# EAGLE design SunbotSchematic copy (EAGLE 8.7.1)
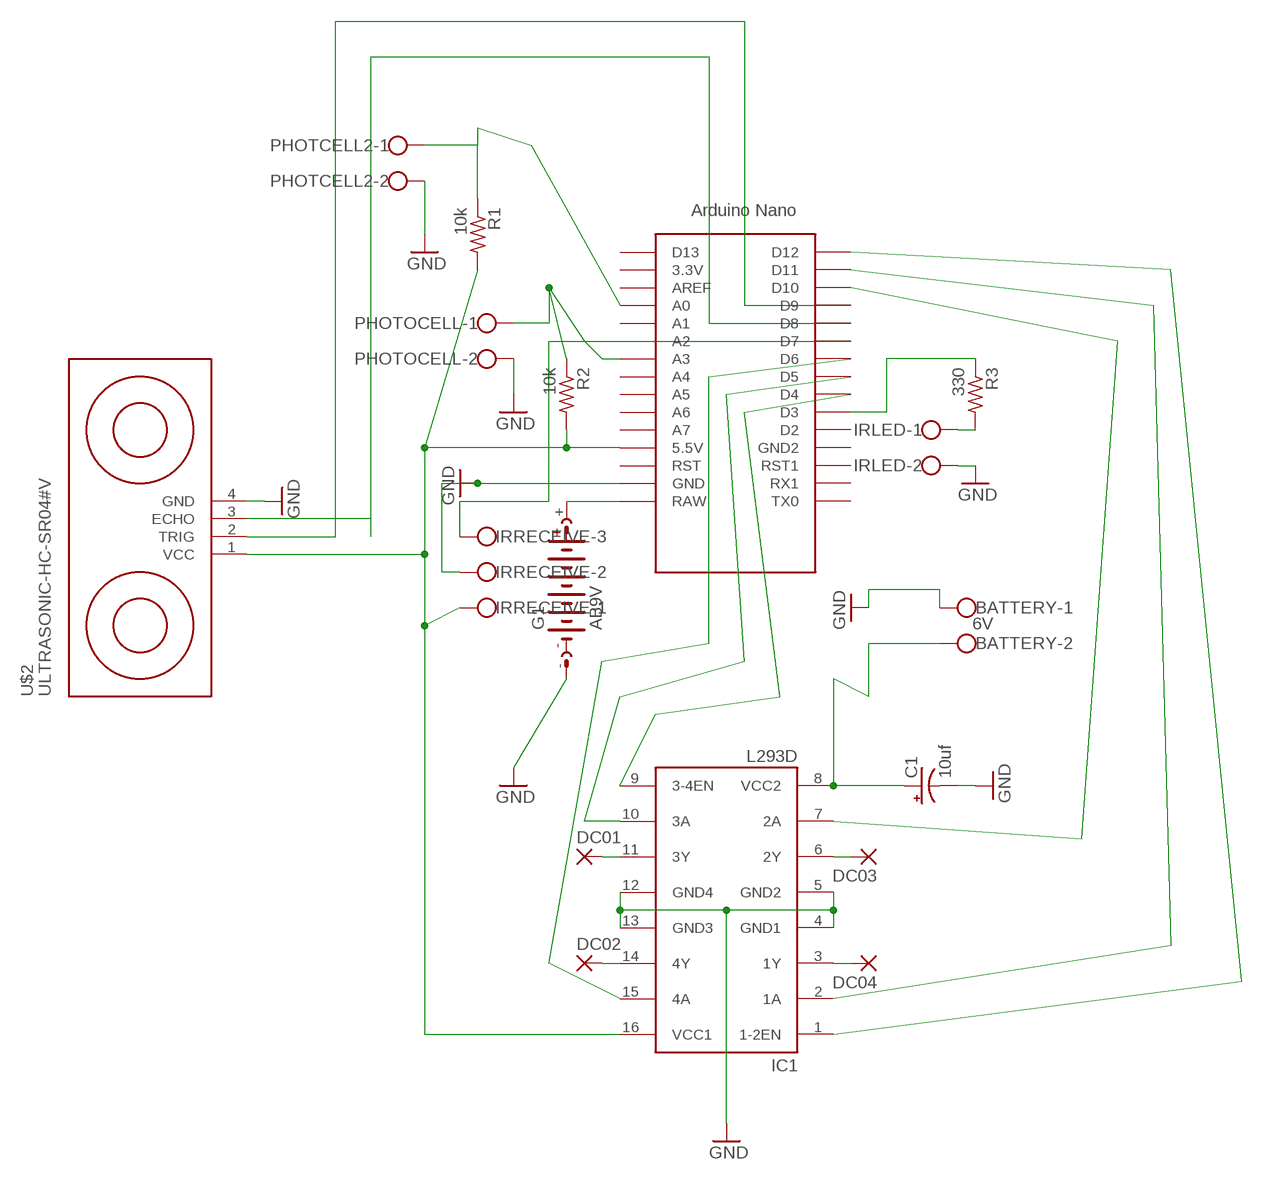
[diagram p0: schematic, sheet 1]

## Parts
BATTERY  6V  W237-102  [W237-102]
C1  10uf  CPOL-USE2-5  [E2-5]
DC01  WIREPAD1,6/0,8  [1,6/0,8]
DC02  WIREPAD1,6/0,8  [1,6/0,8]
DC03  WIREPAD1,6/0,8  [1,6/0,8]
DC04  WIREPAD1,6/0,8  [1,6/0,8]
G1  AB9V  [AB9V]
IC1  L293D  [DIL16]
IRLED  W237-102  [W237-102]
IRRECEIVE  W237-103  [W237-103]
PHOTCELL2  W237-102  [W237-102]
PHOTOCELL  W237-102  [W237-102]
R1  10k  R-US_0204/7  [0204/7]
R2  10k  R-US_0204/7  [0204/7]
R3  330  R-US_0204/7  [0204/7]
U$1  NANO  [NANO]
U$2  ULTRASONIC-HC-SR04#V  [ULTRASONIC-HC-SR04#V]

## Nets
GND: BATTERY.1 C1.- G1.- IC1.4(GND1) IC1.5(GND2) IC1.12(GND4) IC1.13(GND3) IRLED.2 IRRECEIVE.2 PHOTCELL2.2 PHOTOCELL.2 U$1.GND U$2.4(GND)
N$1: G1.+ U$1.RAW
N$3: IC1.9(3-4EN) U$1.D4
N$4: IC1.10(3A) U$1.D5
N$5: IC1.15(4A) U$1.D6
N$6: DC01.1(P) IC1.11(3Y)
N$7: DC02.1(P) IC1.14(4Y)
N$8: DC03.1(P) IC1.6(2Y)
N$9: DC04.1(P) IC1.3(1Y)
N$10: IC1.1(1-2EN) U$1.D12
N$11: IC1.2(1A) U$1.D11
N$12: IC1.7(2A) U$1.D10
N$13: BATTERY.2 C1.+ IC1.8(VCC2)
N$14: U$1.D9 U$2.2(TRIG)
N$15: U$1.D8 U$2.3(ECHO)
N$16: PHOTOCELL.1 R2.1 U$1.A3
N$17: PHOTCELL2.1 R1.1 U$1.A0
N$18: IRLED.1 R3.2
N$19: R3.1 U$1.D3
N$21: IRRECEIVE.3 U$1.D7
PHOTOCELL: IC1.16(VCC1) IRRECEIVE.1 R1.2 R2.2 U$1.5V(5.5V) U$2.1(VCC)
Unconnected: U$1.3.3V U$1.A1 U$1.A2 U$1.A4 U$1.A5 U$1.A6 U$1.A7 U$1.AREF U$1.D2 U$1.D13 U$1.GND1(GND2) U$1.ICSP1 U$1.ICSP2 U$1.ICSP3 U$1.ICSP4 U$1.ICSP5 U$1.ICSP6 U$1.RST U$1.RST1 U$1.RX1 U$1.TX0

## Library data of the parts
BATTERY IRLED PHOTCELL2 PHOTOCELL = con-wago-500:W237-102: WAGO SCREW CLAMP; MPN: 237-102; OC_FARNELL: unknown; OC_NEWARK: 70K9898
C1 = adafruit:CPOL-US: POLARIZED CAPACITOR, American symbol
DC01-DC04 = wirepad:WIREPAD: Wire PAD connect wire on PCB
G1 = battery:AB9V: 9-V BATTERY CLIP
IC1 = st-microelectronics:L293D: PUSH-PULL 4 CHANNEL DRIVER; MPN: L293D; OC_FARNELL: 9589619; OC_NEWARK: 56P8249
IRRECEIVE = con-wago-500:W237-103: WAGO SCREW CLAMP; MPN: 237-103; OC_FARNELL: unknown; OC_NEWARK: 18M7116
R1-R3 = adafruit:R-US_: RESISTOR, American symbol
U$1 = Arduino-clone:NANO: Arduino Nano
U$2 = diy-modules:ULTRASONIC-HC-SR04: Ultrasonic Ranging Module HC-SR04 More details available here: http://randomnerdtutorials.com/complete-guide-for-ultrasonic-sensor-hc-sr04/ Click here to find device on ebay.com <http://www.ebay.com/sch/hc+sr04+ultrasonic>

## Net classes
0 default: width 0.305 mm, drill 0.508 mm, clearance 0.381 mm

## Board
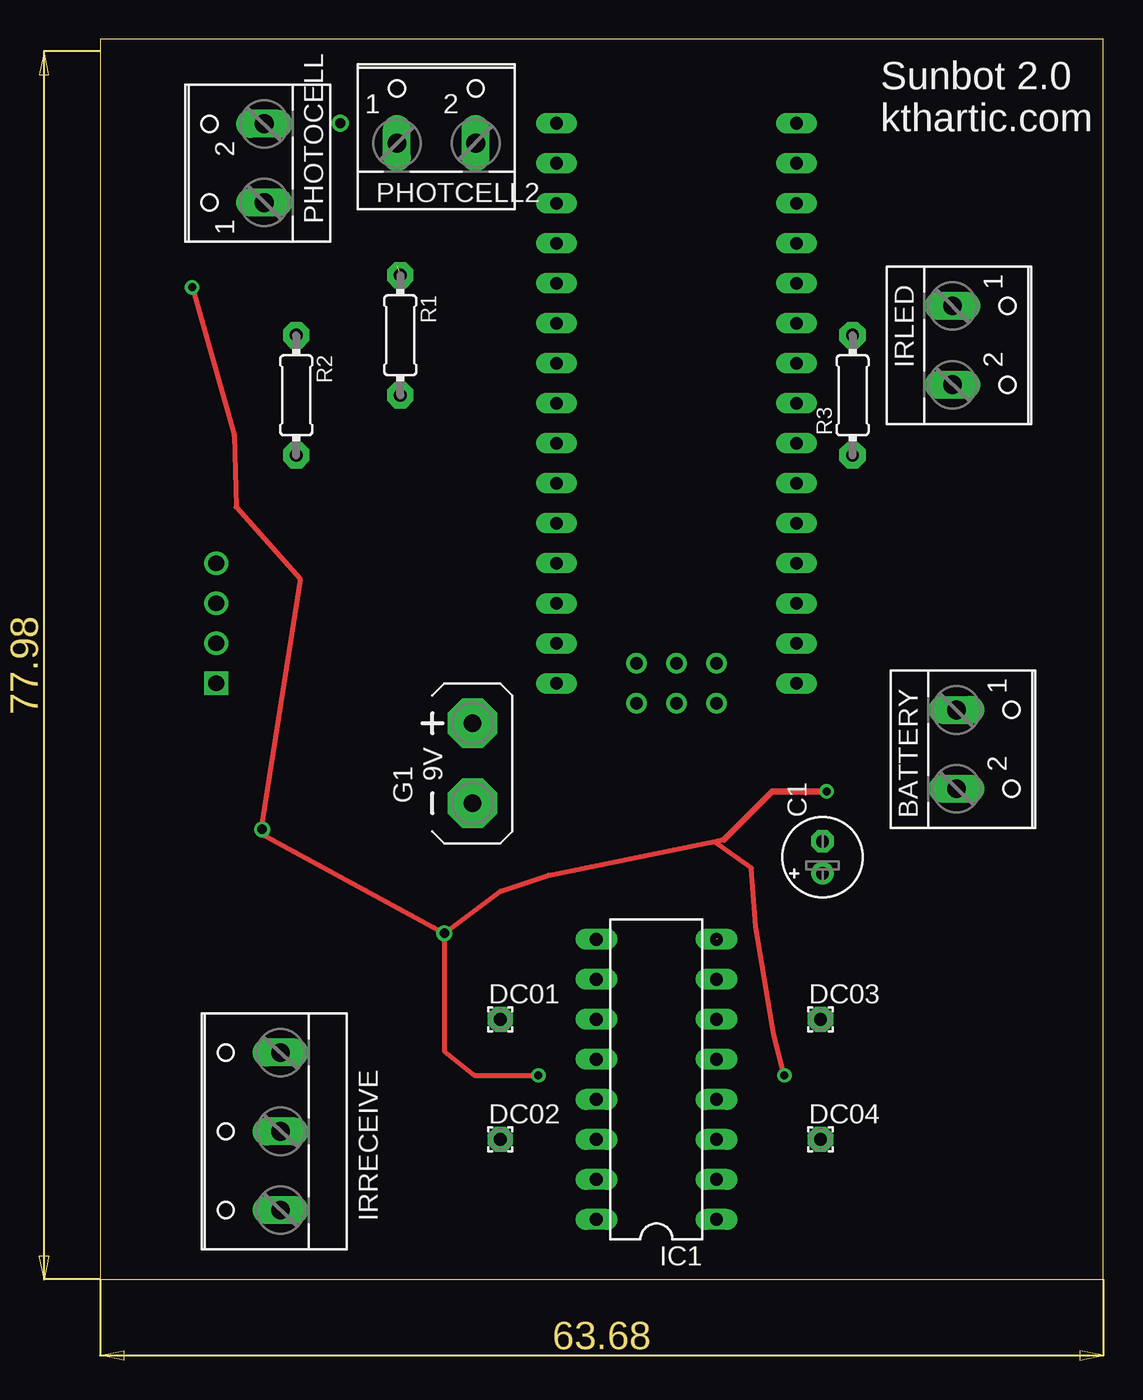
[diagram p1: board, top side]
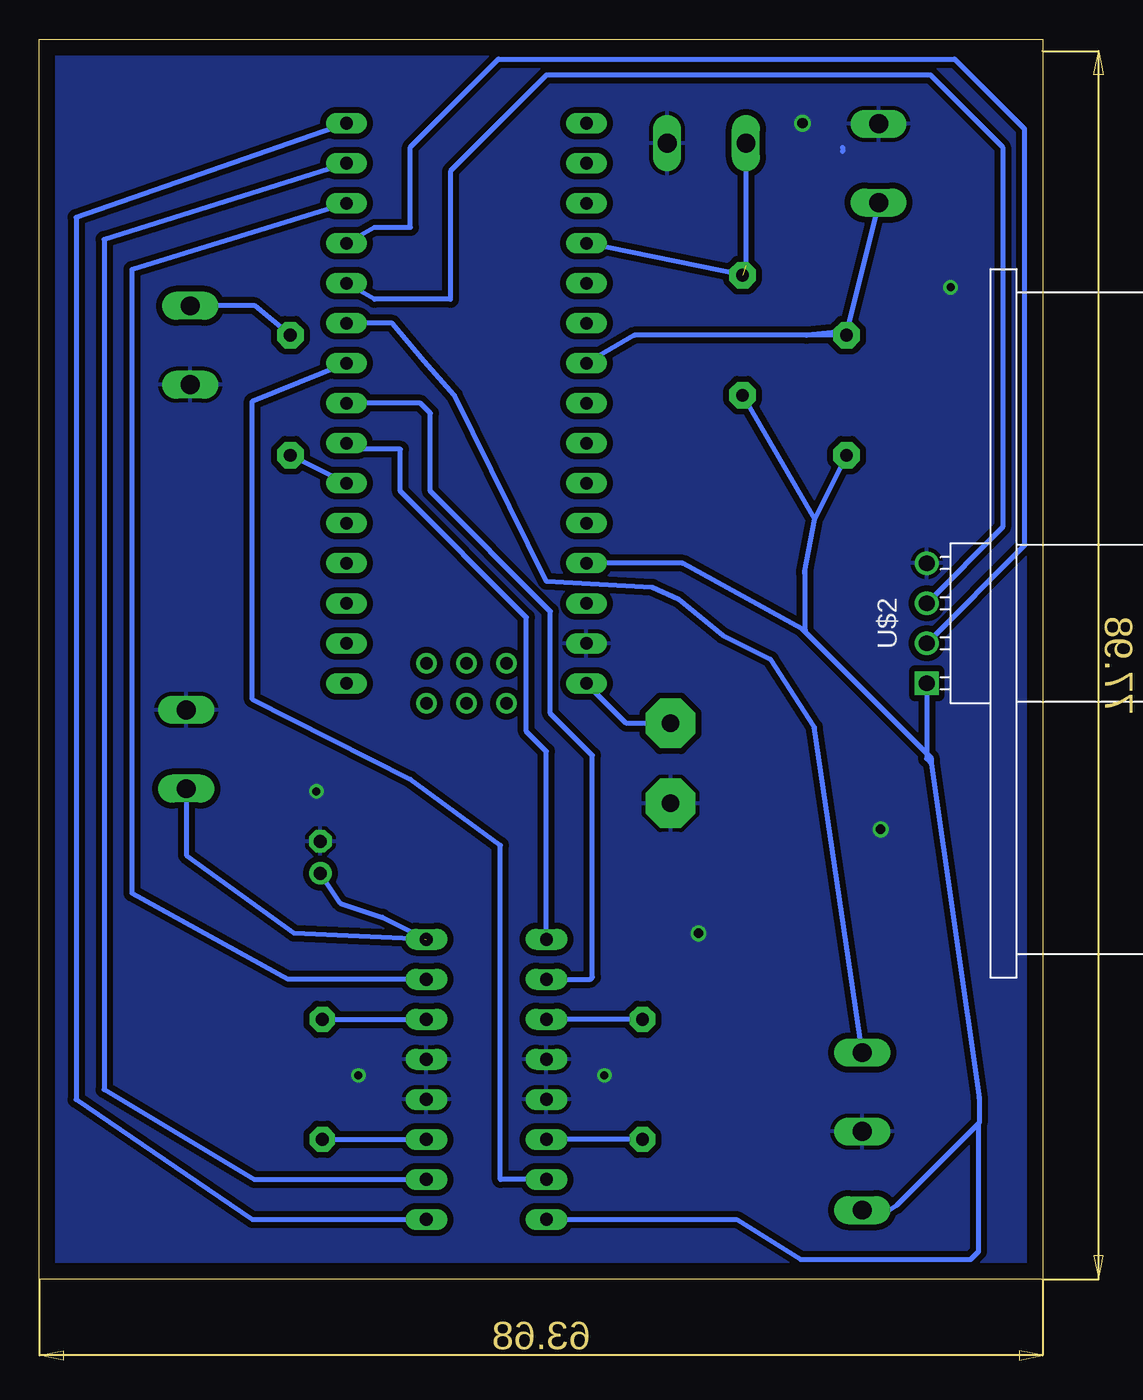
[diagram p2: board, bottom side, seen from below]

Size 63.68 x 78.73 mm. Coordinates in mm from the lower left corner, seen from the top.
Outline: 0,0 63.68,0 63.68,78.73 0,78.73 0,0
Copper layers (1*16): Top 0.035mm / dielectric 1.5mm / Bottom 0.035mm
Design rules "default": minimum track width 6mil, minimum drill 0.35mm, track to track 6mil, track to pad 6mil, pad to pad 6mil, via to via 6mil, smd to smd 6mil, copper to edge 40mil, drill to drill 6mil, minimum pad ring 10mil, minimum via ring 8mil, stop-mask expansion 4mil, vias tented up to drill 0mil, thermal gap 10mil

### Footprints (pad centres in the part's own frame; a part is rotated, then mirrored left to right if it is on the bottom)
W237-102 = drill 1.194 long: 1 -2.5,-1.27; 2 2.5,-1.27
E2-5 = drill 0.813 pad 1.422: + -1.016,0 | drill 0.813 pad 1.422 octagon: - 1.016,0
1,6/0,8 = drill 0.813 pad 1.6 octagon: 1 0,0
AB9V = drill 1.118 pad 3.15 octagon: + 0,2.54; - 0,-2.54
DIL16 = drill 0.813 long: 1 -8.89,-3.81; 2 -6.35,-3.81; 3 -3.81,-3.81; 4 -1.27,-3.81; 5 1.27,-3.81; 6 3.81,-3.81; 7 6.35,-3.81; 8 8.89,-3.81; 9 8.89,3.81; 10 6.35,3.81; 11 3.81,3.81; 12 1.27,3.81; 13 -1.27,3.81; 14 -3.81,3.81; 15 -6.35,3.81; 16 -8.89,3.81
W237-103 = drill 1.194 long: 1 -5,-1.29; 2 0,-1.29; 3 5,-1.29
0204/7 = drill 0.813 pad 1.676 octagon: 1 -3.81,0; 2 3.81,0
NANO = drill 0.8 long: 3.3V -10.16,24.13; 5V -10.16,-1.27; A0 -10.16,19.05; A1 -10.16,16.51; A2 -10.16,13.97; A3 -10.16,11.43; A4 -10.16,8.89; A5 -10.16,6.35; A6 -10.16,3.81; A7 -10.16,1.27; AREF -10.16,21.59; D2 5.08,1.27; D3 5.08,3.81; D4 5.08,6.35; D5 5.08,8.89; D6 5.08,11.43; D7 5.08,13.97; D8 5.08,16.51; D9 5.08,19.05; D10 5.08,21.59; D11 5.08,24.13; D12 5.08,26.67; D13 -10.16,26.67; GND -10.16,-6.35; GND1 5.08,-1.27; RAW -10.16,-8.89; RST -10.16,-3.81; RST1 5.08,-3.81; RX1 5.08,-6.35; TX0 5.08,-8.89 | drill 0.8: ICSP1 -5.08,-10.16; ICSP2 -5.08,-7.62; ICSP3 -2.54,-10.16; ICSP4 -2.54,-7.62; ICSP5 0,-10.16; ICSP6 0,-7.62
ULTRASONIC-HC-SR04#V = drill 1 square: 1 -3.81,0 | drill 1: 2 -1.27,0; 3 1.27,0; 4 3.81,0

### Placement (x,y rotation side)
BATTERY  55.63,33.66 270 top
C1  45.85,26.8 90 top
DC01  25.4,16.51 0 top
DC02  25.4,8.89 0 top
DC03  45.72,16.51 0 top
DC04  45.72,8.89 0 top
G1  23.62,32.77 0 top
IC1  35.31,12.7 90 top
IRLED  55.37,59.31 270 top
IRRECEIVE  10.16,9.4 90 top
PHOTCELL2  21.34,73.41 0 top
PHOTOCELL  9.14,70.87 90 top
R1  19.05,59.94 270 top
R2  12.45,56.13 270 top
R3  47.75,56.13 90 top
U$1  39.12,46.74 0 top
U$2  7.37,41.66 90 bottom

### Tracks (layer width: path | path; a pad name or v marks a point on that pad's centre or on a via)
GND  (via drill 0.51, 0.6, 0.65)
  Top 0.305: v5.84,62.99 8.51,53.59 8.64,49.02 12.7,44.45 10.16,28.32 v21.84,21.97 | v21.84,21.97 25.4,24.64 28.45,25.65 39.62,27.94 39.05,27.75 41.34,26.11 41.6,22.41 42.75,15.54 v43.43,12.95 | v21.84,21.97 21.84,14.48 23.75,12.95 v27.81,12.95
  Top 0.406: 39.62,27.94 42.67,30.99 v46.1,30.99
  Bottom 0.305: 12.7,71.88 12.7,71.62
  other vias: 10.29,28.57 15.24,73.41
  pour Bottom: 0.25,78.74 0.25,-0.13 63.75,-0.13 63.75,78.74
N$1
  Bottom 0.305: U$1.RAW 26.42,35.31 G1.+
N$3
  Bottom 0.305: IC1.9 31.5,33.53 32.77,34.8 32.77,42.04 40.77,50.04 40.77,52.71 43.81,52.71 U$1.D4
N$4
  Bottom 0.305: IC1.10 28.7,19.05 28.57,19.18 28.57,33.27 31.24,35.94 31.24,42.42 38.86,50.04 38.86,54.99 39.5,55.63 U$1.D5
N$5
  Bottom 0.305: U$1.D6 50.16,55.75 50.16,36.83 40.13,31.75 34.42,27.56 34.42,6.35 IC1.15
N$6
  Bottom 0.305: DC01.1 IC1.11
N$7
  Bottom 0.305: DC02.1 IC1.14
N$8
  Bottom 0.305: DC03.1 IC1.6
N$9
  Bottom 0.305: DC04.1 IC1.3
N$10
  Bottom 0.305: U$1.D12 61.34,67.44 61.34,11.43 50.16,3.81 40.13,3.81 40.01,3.87 39.37,3.87 IC1.1
N$11
  Bottom 0.305: U$1.D11 59.56,66.04 59.56,12.07 50.04,6.35 39.69,6.35 | 39.69,6.35 39.62,6.35 | IC1.2 39.37,6.41 39.69,6.41 39.69,6.35
N$12
  Bottom 0.305: U$1.D10 57.78,64.13 57.78,24.51 47.88,19.05 IC1.7
N$13  (1 unrouted)
  Bottom 0.305: IC1.8 41.91,22.99 44.58,23.88 C1.+ | BATTERY.2 54.36,26.92 47.52,21.99 39.21,21.61
N$14
  Bottom 0.305: U$1.D9 42.42,66.8 40.13,66.8 40.13,71.88 34.54,77.47 5.59,77.47 1.17,73.05 1.17,46.58 U$2.2
N$15
  Bottom 0.305: U$1.D8 42.42,62.23 37.59,62.23 37.59,70.36 31.5,76.45 7.11,76.45 2.54,71.88 2.54,47.75 U$2.3
N$16
  Bottom 0.305: U$1.A3 25.91,59.94 14.99,59.94 | R2.1 14.99,59.94 | PHOTOCELL.1 12.45,60.2 14.99,59.94
N$17  (1 unrouted)
  Bottom 0.305: R1.1 U$1.A0 | PHOTCELL2.1 18.84,64.35
N$18
  Bottom 0.305: R3.2 50,61.81 IRLED.1
N$19
  Bottom 0.305: R3.1 U$1.D3
N$21
  Bottom 0.305: IRRECEIVE.3 14.5,35.07 17.27,39.37 20.32,40.89 23.11,43.18 24.77,43.94 31.5,44.32 37.34,56.13 39.24,58.29 41.27,60.71 U$1.D7
PHOTOCELL
  Bottom 0.305: 14.48,48.26 R1.2 | R2.2 14.48,48.26 | 7.08,32.77 4.03,11.51 | 4.03,11.51 4.02,11.43 | 15.11,44.83 15.09,44.93 | 15.09,44.93 14.48,48.26 | 15.28,41.32 15.07,41.21 15.09,41.23 15.09,44.93 | 15.28,41.32 22.86,45.47 U$1.5V | 4.03,11.51 4.03,9.94 4.06,9.91 | 4.06,9.91 9.27,4.7 9.73,4.4 IRRECEIVE.1 | IC1.16 19.43,3.81 15.37,1.27 4.57,1.27 4.06,1.78 4.06,9.91 | 15.28,41.32 7.08,33.11 7.08,32.77 | U$2.1 7.37,33.06 7.08,32.77

### Text on the board
tNames: Sunbot 2.0 / kthartic.com